# Altium schematic sheet A1-POWER.SchDoc
size A
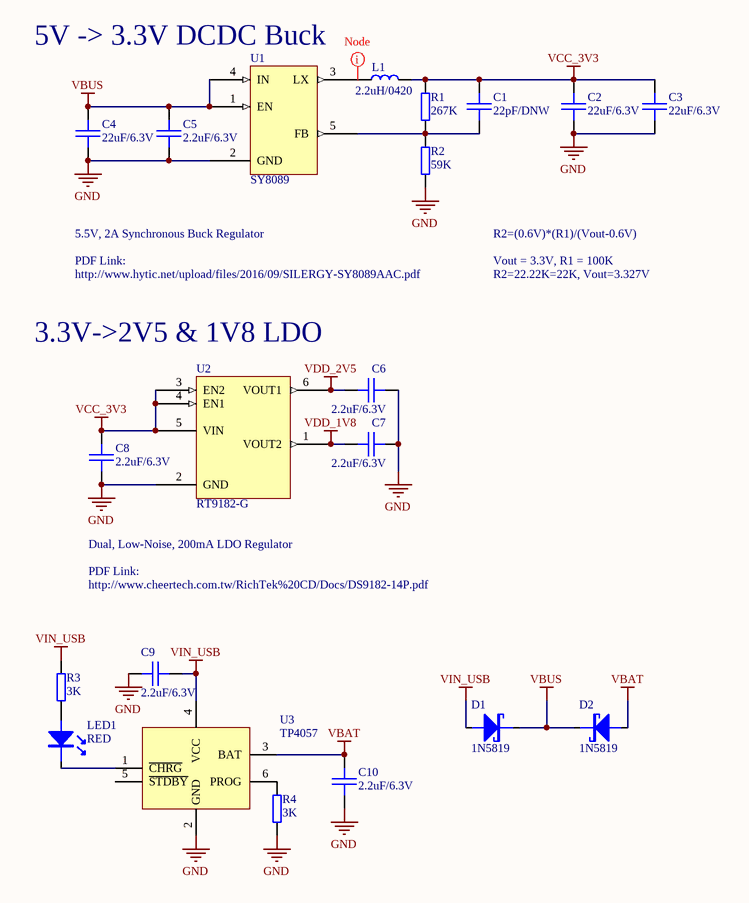
[diagram p0: A1-POWER.SchDoc]

## Parts
C1  22pF/DNW  [SMT_C_0402]
C2  22uF/6.3V  [SMT_C_0805]
C3  22uF/6.3V  [SMT_C_0805]
C4  22uF/6.3V  [SMT_C_0805]
C5  2.2uF/6.3V  [SMT_C_0402]
C6  2.2uF/6.3V  [SMT_C_0402]
C7  2.2uF/6.3V  [SMT_C_0402]
C8  2.2uF/6.3V  [SMT_C_0402]
C9  2.2uF/6.3V  [SMT_C_0402]
C10  2.2uF/6.3V  [SMT_C_0402]
D1  1N5819  [SMT_DIODE_SOD_323]
D2  1N5819  [SMT_DIODE_SOD_323]
L1  2.2uH/0420  [SMT_L_3.3mm]
LED1  RED  [SMT_LED_0402]
R1  267K  [SMT_R_0402]
R2  59K  [SMT_R_0402]
R3  3K  [SMT_R_0402]
R4  3K  [SMT_R_0402]
U1  SY8089  [SOT23-5]
U2  RT9182-G  [SOT23-6]
U3  TP4057  [SOT23-6]

## Nets
GND: C2.2 C3.2 C4.2 C5.2 C6.2 C7.2 C8.2 C9.2 C10.1 R2.1 R4.1 U1.2(GND) U2.2(GND) U3.2(GND)
VBAT: C10.2 D2.1(A) U3.3(BAT)
VBUS: C4.1 C5.1 D1.2(K) D2.2(K) U1.1(EN) U1.4(IN)
VCC_3V3: C1.1 C2.1 C3.1 C8.1 L1.1 R1.2 U2.3(EN2) U2.4(EN1) U2.5(VIN)
VDD_1V8: C7.1 U2.1(VOUT2)
VDD_2V5: C6.1 U2.6(VOUT1)
VIN_USB: C9.1 D1.1(A) R3.2 U3.4(VCC)
NetC1_2: C1.2 R1.1 R2.2 U1.5(FB)
NetL1_2: L1.2 U1.3(LX)
NetLED1_1: LED1.1(A) R3.1
NetLED1_2: LED1.2(K) U3.1(~{CHRG})
NetR4_2: R4.2 U3.6(PROG)

Not connected (* = marked no-connect by the designer): U3 5(~{STDBY})

## Layout directives
mark named Node: NetL1_2

## Notes on the sheet
- (near U1) 5V -> 3.3V DCDC Buck
- PDF Link:
- 5.5V, 2A Synchronous Buck Regulator
- R2=(0.6V)*(R1)/(Vout-0.6V)
- Vout = 3.3V, R1 = 100K
- http://www.hytic.net/upload/files/2016/09/SILERGY-SY8089AAC.pdf
- R2=22.22K=22K, Vout=3.327V
- 3.3V->2V5 & 1V8 LDO
- http://www.cheertech.com.tw/RichTek%20CD/Docs/DS9182-14P.pdf
- Dual, Low-Noise, 200mA LDO Regulator

## Library data of the parts
C1 C5-C10 = SMT_C_0402: Surface mount capacitor 0402
C2-C4 = SMT_C_0805: Surface mount capacitor 0805
D1 D2 = SMT_DIODE_SCHOTTKY_SOD_323: Surface mount schottky diode SOD-323(0805) Package
L1 = SMT_L_3.3mm: LPO3310 SMT Power Inductor, 3.3x3.3x1mm
LED1 = SMT_LED_0402: SMT LED
R1-R4 = SMT_R_0402: Surface mount resistor 0402
U1 = SY8089: High Efficiency 5.5V, 2A continuous, 3A peak, 1MHz  Synchronous Step Down Regulator
U2 = RT9182: The RT9182 is a dual-channel, low noise, and low dropout / regulator supplying up to 200mA current at each channel. / The output voltage ranges from 1.5V to 3.3V in 100mV / increments and 2% accuracy by operating from a +2.7V / to +5.5V input.
U3 = TP4057: 500mA lithium-ion battery linear charger, LDO